# Altium project bme_ads1299.PrjPcb
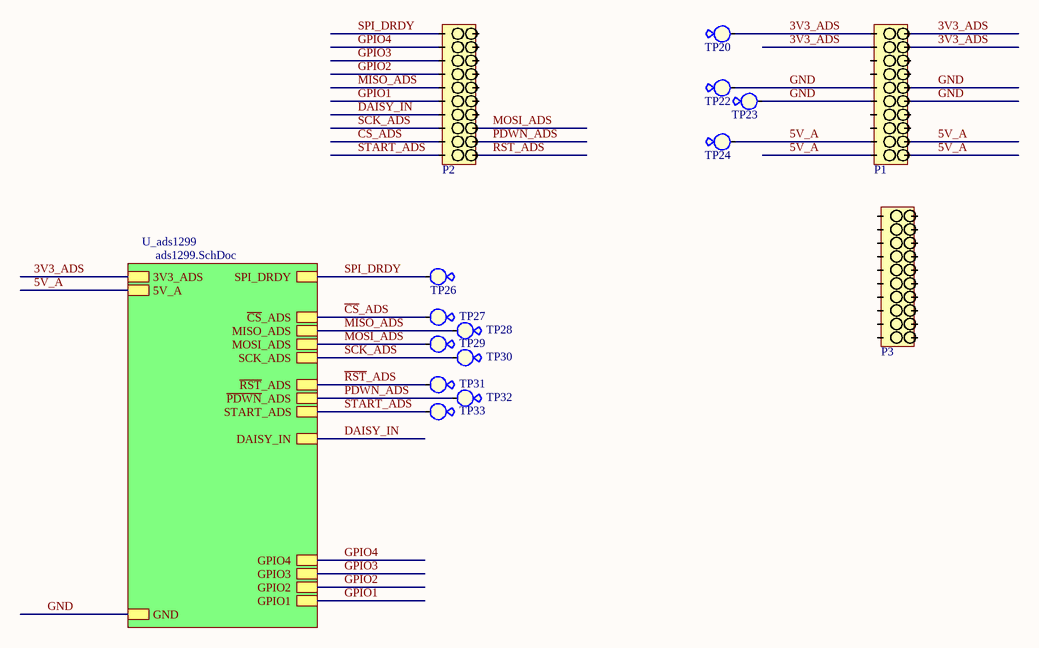
[diagram p0: bme_ads1299.SchDoc]
2 sheets, 104 parts. Net scope: strictly hierarchical (ports join the sheet entries above them; power ports are local).
Board file: ads1299.PcbDoc
Sheets:
  bme_ads1299.SchDoc
    U_ads1299 = ads1299.SchDoc

## Sheet bme_ads1299.SchDoc
size A4; DocumentNumber: 1; SheetNumber: 1; SheetTotal: 2

### Parts
P1  Mount Header (Male) 1.27mm  [M50-4301045]  (value not drawn)
P2  Mount Header (Male) 1.27mm  [M50-4301045]  (value not drawn)
P3  Mount Header (Male) 1.27mm  [M50-4301045]  (value not drawn)
TP20  Test Point  [testPoint]  (value not drawn)
TP22  Test Point  [testPoint]  (value not drawn)
TP23  Test Point  [testPoint]  (value not drawn)
TP24  Test Point  [testPoint]  (value not drawn)
TP26  Test Point  [testPoint]  (value not drawn)
TP27  Test Point  [testPoint]  (value not drawn)
TP28  Test Point  [testPoint]  (value not drawn)
TP29  Test Point  [testPoint]  (value not drawn)
TP30  Test Point  [testPoint]  (value not drawn)
TP31  Test Point  [testPoint]  (value not drawn)
TP32  Test Point  [testPoint]  (value not drawn)
TP33  Test Point  [testPoint]  (value not drawn)

### Sub-sheets
U_ads1299 = ads1299.SchDoc: GPIO4, GPIO2, GPIO3, START_ADS, GPIO1, DAISY_IN, 3V3_ADS, 5V_A, GND, SCK_ADS, MISO_ADS, MOSI_ADS, ~{CS}_ADS, ~{RST}_ADS, ~{PDWN}_ADS, SPI_DRDY

### Nets
3V3_ADS: P1.1 P1.2 P1.19 P1.20 TP20.0 ; sheet U_ads1299/3V3_ADS
5V_A: P1.9 P1.10 P1.11 P1.12 TP24.0 ; sheet U_ads1299/5V_A
GND: P1.5 P1.6 P1.15 P1.16 TP22.0 TP23.0 ; sheet U_ads1299/GND
~{CS}_ADS: P2.9 TP27.0 ; sheet U_ads1299/~{CS}_ADS
DAISY_IN: P2.7 ; sheet U_ads1299/DAISY_IN
GPIO1: P2.6 ; sheet U_ads1299/GPIO1
GPIO2: P2.4 ; sheet U_ads1299/GPIO2
GPIO3: P2.3 ; sheet U_ads1299/GPIO3
GPIO4: P2.2 ; sheet U_ads1299/GPIO4
MISO_ADS: P2.5 TP28.0 ; sheet U_ads1299/MISO_ADS
MOSI_ADS: P2.13 TP29.0 ; sheet U_ads1299/MOSI_ADS
~{PDWN}_ADS: P2.12 TP32.0 ; sheet U_ads1299/~{PDWN}_ADS
~{RST}_ADS: P2.11 TP31.0 ; sheet U_ads1299/~{RST}_ADS
SCK_ADS: P2.8 TP30.0 ; sheet U_ads1299/SCK_ADS
SPI_DRDY: P2.1 TP26.0 ; sheet U_ads1299/SPI_DRDY
START_ADS: P2.10 TP33.0 ; sheet U_ads1299/START_ADS

Not connected (* = marked no-connect by the designer): P1 3 4 7 8 13 14 17 18; P2 14 15 16 17 18 19 20; P3 1 2 3 4 5 6 7 8 9 10 11 12 13 14 15 16 17 18 19 20

### Library data of the parts
P1-P3 = 2x10 Mount Header (Male) 1.27mm: 2x10 Mount Header (Male); Value: 2x10 Mount Header, 1.27mm; Farnell: 1099531; Supplier: Krille har
TP20 TP22-TP24 TP26-TP33 = Test Point: Value: Test point; Farnell: 1702006

## Sheet ads1299.SchDoc
size A3; DocumentNumber: 2; SheetNumber: 2; SheetTotal: 2
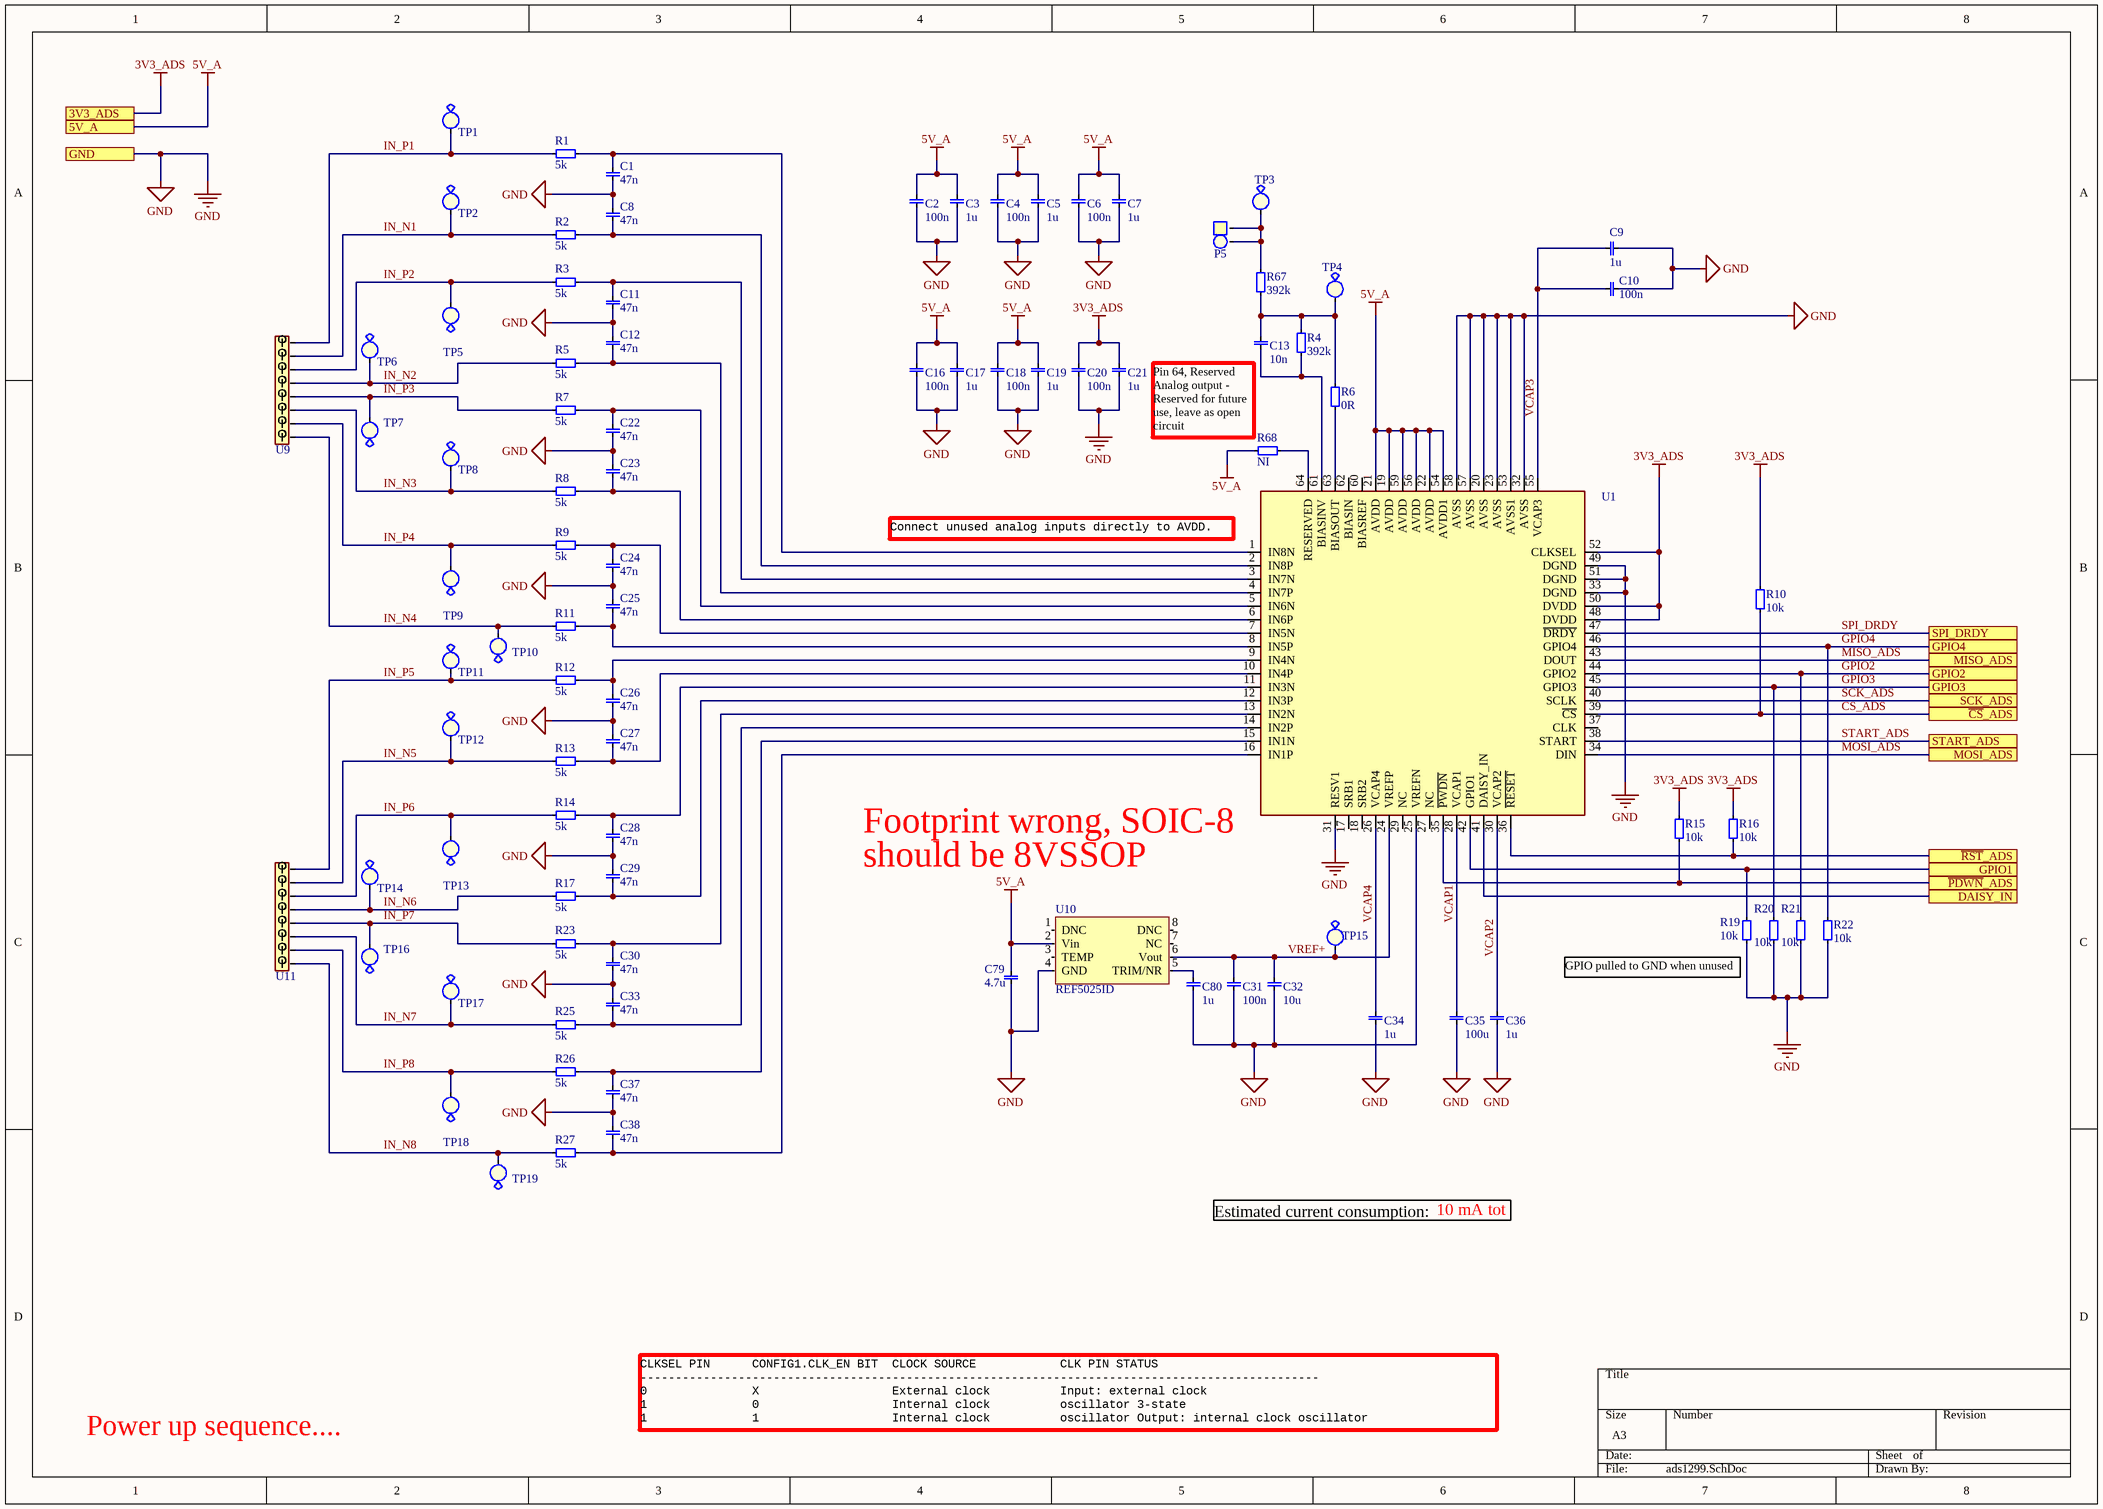
[diagram p1: ads1299.SchDoc]

### Parts
C1  value 47n  [0603 cap]  (hidden comment: 0603, capacitor)
C2  value 100n  [0603 cap]  (hidden comment: 0603, capacitor)
C3  value 1u  [0603 cap]  (hidden comment: 0603, capacitor)
C4  value 100n  [0603 cap]  (hidden comment: 0603, capacitor)
C5  value 1u  [0603 cap]  (hidden comment: 0603, capacitor)
C6  value 100n  [0603 cap]  (hidden comment: 0603, capacitor)
C7  value 1u  [0603 cap]  (hidden comment: 0603, capacitor)
C8  value 47n  [0603 cap]  (hidden comment: 0603, capacitor)
C9  value 1u  [0603 cap]  (hidden comment: 0603, capacitor)
C10  value 100n  [0603 cap]  (hidden comment: 0603, capacitor)
C11  value 47n  [0603 cap]  (hidden comment: 0603, capacitor)
C12  value 47n  [0603 cap]  (hidden comment: 0603, capacitor)
C13  value 10n  [0603 cap]  (hidden comment: 0603, capacitor)
C16  value 100n  [0603 cap]  (hidden comment: 0603, capacitor)
C17  value 1u  [0603 cap]  (hidden comment: 0603, capacitor)
C18  value 100n  [0603 cap]  (hidden comment: 0603, capacitor)
C19  value 1u  [0603 cap]  (hidden comment: 0603, capacitor)
C20  value 100n  [0603 cap]  (hidden comment: 0603, capacitor)
C21  value 1u  [0603 cap]  (hidden comment: 0603, capacitor)
C22  value 47n  [0603 cap]  (hidden comment: 0603, capacitor)
C23  value 47n  [0603 cap]  (hidden comment: 0603, capacitor)
C24  value 47n  [0603 cap]  (hidden comment: 0603, capacitor)
C25  value 47n  [0603 cap]  (hidden comment: 0603, capacitor)
C26  value 47n  [0603 cap]  (hidden comment: 0603, capacitor)
C27  value 47n  [0603 cap]  (hidden comment: 0603, capacitor)
C28  value 47n  [0603 cap]  (hidden comment: 0603, capacitor)
C29  value 47n  [0603 cap]  (hidden comment: 0603, capacitor)
C30  value 47n  [0603 cap]  (hidden comment: 0603, capacitor)
C31  value 100n  [0603 cap]  (hidden comment: 0603, capacitor)
C32  value 10u  [0603 cap]  (hidden comment: 0603, capacitor)
C33  value 47n  [0603 cap]  (hidden comment: 0603, capacitor)
C34  value 1u  [0603 cap]  (hidden comment: 0603, capacitor)
C35  value 100u  [1210, cap]  (hidden comment: 1210, capacitor)
C36  value 1u  [0603 cap]  (hidden comment: 0603, capacitor)
C37  value 47n  [0603 cap]  (hidden comment: 0603, capacitor)
C38  value 47n  [0603 cap]  (hidden comment: 0603, capacitor)
C79  value 4.7u  [0603 cap]  (hidden comment: 0603, capacitor)
C80  value 1u  [0603 cap]  (hidden comment: 0603, capacitor)
P5  1x2 Pin Header  [padtwo_L]  (value not drawn)
R1  value 5k  [0603]  (hidden comment: 0603, resistor)
R2  value 5k  [0603]  (hidden comment: 0603, resistor)
R3  value 5k  [0603]  (hidden comment: 0603, resistor)
R4  value 392k  [0603]  (hidden comment: 0603, resistor)
R5  value 5k  [0603]  (hidden comment: 0603, resistor)
R6  value 0R  [0603]  (hidden comment: 0603, resistor)
R7  value 5k  [0603]  (hidden comment: 0603, resistor)
R8  value 5k  [0603]  (hidden comment: 0603, resistor)
R9  value 5k  [0603]  (hidden comment: 0603, resistor)
R10  value 10k  [0603]  (hidden comment: 0603, resistor)
R11  value 5k  [0603]  (hidden comment: 0603, resistor)
R12  value 5k  [0603]  (hidden comment: 0603, resistor)
R13  value 5k  [0603]  (hidden comment: 0603, resistor)
R14  value 5k  [0603]  (hidden comment: 0603, resistor)
R15  value 10k  [0603]  (hidden comment: 0603, resistor)
R16  value 10k  [0603]  (hidden comment: 0603, resistor)
R17  value 5k  [0603]  (hidden comment: 0603, resistor)
R19  value 10k  [0603]  (hidden comment: 0603, resistor)
R20  value 10k  [0603]  (hidden comment: 0603, resistor)
R21  value 10k  [0603]  (hidden comment: 0603, resistor)
R22  value 10k  [0603]  (hidden comment: 0603, resistor)
R23  value 5k  [0603]  (hidden comment: 0603, resistor)
R25  value 5k  [0603]  (hidden comment: 0603, resistor)
R26  value 5k  [0603]  (hidden comment: 0603, resistor)
R27  value 5k  [0603]  (hidden comment: 0603, resistor)
R67  value 392k  [0603]  (hidden comment: 0603, resistor)
R68  value NI  [0603]  (hidden comment: 0603, resistor)
TP1  Test Point  [testPoint]  (value not drawn)
TP2  Test Point  [testPoint]  (value not drawn)
TP3  Test Point  [testPoint]  (value not drawn)
TP4  Test Point  [testPoint]  (value not drawn)
TP5  Test Point  [testPoint]  (value not drawn)
TP6  Test Point  [testPoint]  (value not drawn)
TP7  Test Point  [testPoint]  (value not drawn)
TP8  Test Point  [testPoint]  (value not drawn)
TP9  Test Point  [testPoint]  (value not drawn)
TP10  Test Point  [testPoint]  (value not drawn)
TP11  Test Point  [testPoint]  (value not drawn)
TP12  Test Point  [testPoint]  (value not drawn)
TP13  Test Point  [testPoint]  (value not drawn)
TP14  Test Point  [testPoint]  (value not drawn)
TP15  Test Point  [testPoint]  (value not drawn)
TP16  Test Point  [testPoint]  (value not drawn)
TP17  Test Point  [testPoint]  (value not drawn)
TP18  Test Point  [testPoint]  (value not drawn)
TP19  Test Point  [testPoint]  (value not drawn)
U1  ADS1299  [TQFP64_05MM_P]  (value not drawn)
U9  1x8 Screw terminal  [screw_term_8_pos]  (value not drawn)
U10  REF5025ID  [SOIC8]
U11  1x8 Screw terminal  [screw_term_8_pos]  (value not drawn)

### Ports
3V3_ADS, 5V_A, DAISY_IN, GND, GPIO1, GPIO2, GPIO3, GPIO4, MISO_ADS, MOSI_ADS, SCK_ADS, SPI_DRDY, START_ADS, ~{CS}_ADS, ~{PDWN}_ADS, ~{RST}_ADS

### Nets
3V3_ADS: C20.1 C21.1 R10.0 R15.0 R16.0 U1.48(DVDD) U1.50(DVDD) U1.52(CLKSEL) ; port 3V3_ADS
5V_A: C2.1 C3.1 C4.1 C5.1 C6.1 C7.1 C16.1 C17.1 C18.1 C19.1 C79.1 R68.0 U1.19(AVDD) U1.21(AVDD) U1.22(AVDD) U1.54(AVDD1) U1.56(AVDD) U1.59(AVDD) U10.2(Vin) ; port 5V_A
GND: C1.0 C2.0 C3.0 C4.0 C5.0 C6.0 C7.0 C8.0 C9.0 C10.0 C11.0 C12.0 C16.0 C17.0 C18.0 C19.0 C20.0 C21.0 C22.0 C23.0 C24.0 C25.0 C26.0 C27.0 C28.0 C29.0 C30.0 C31.0 C32.0 C33.0 C34.0 C35.0 C36.0 C37.0 C38.0 C79.0 C80.0 R19.1 R20.1 R21.1 R22.1 U1.20(AVSS) U1.23(AVSS) U1.25(VREFN) U1.31(RESV1) U1.32(AVSS) U1.33(DGND) U1.49(DGND) U1.51(DGND) U1.53(AVSS1) U1.57(AVSS) U1.58(AVSS) U10.4(GND) ; port GND
~{CS}_ADS: R10.1 U1.39(~{CS}) ; port ~{CS}_ADS
DAISY_IN: U1.41(DAISY_IN) ; port DAISY_IN
GPIO1: R19.0 U1.42(GPIO1) ; port GPIO1
GPIO2: R21.0 U1.44(GPIO2) ; port GPIO2
GPIO3: R20.0 U1.45(GPIO3) ; port GPIO3
GPIO4: R22.0 U1.46(GPIO4) ; port GPIO4
IN_N1: R2.1 TP2.0 U9.2
IN_N2: R5.1 TP6.0 U9.4
IN_N3: R8.1 TP8.0 U9.6
IN_N4: R11.1 TP10.0 U9.8
IN_N5: R13.1 TP12.0 U11.2
IN_N6: R17.1 TP14.0 U11.4
IN_N7: R25.1 TP17.0 U11.6
IN_N8: R27.1 TP19.0 U11.8
IN_P1: R1.1 TP1.0 U9.1
IN_P2: R3.1 TP5.0 U9.3
IN_P3: R7.1 TP7.0 U9.5
IN_P4: R9.1 TP9.0 U9.7
IN_P5: R12.1 TP11.0 U11.1
IN_P6: R14.1 TP13.0 U11.3
IN_P7: R23.1 TP16.0 U11.5
IN_P8: R26.1 TP18.0 U11.7
MISO_ADS: U1.43(DOUT) ; port MISO_ADS
MOSI_ADS: U1.34(DIN) ; port MOSI_ADS
~{PDWN}_ADS: R15.1 U1.35(~{PWDN}) ; port ~{PDWN}_ADS
~{RST}_ADS: R16.1 U1.36(~{RESET}) ; port ~{RST}_ADS
SCK_ADS: U1.40(SCLK) ; port SCK_ADS
SPI_DRDY: U1.47(~{DRDY}) ; port SPI_DRDY
START_ADS: U1.38(START) ; port START_ADS
VCAP1: C35.1 U1.28(VCAP1)
VCAP2: C36.1 U1.30(VCAP2)
VCAP3: C9.1 C10.1 U1.55(VCAP3)
VCAP4: C34.1 U1.26(VCAP4)
VREF+: C31.1 C32.1 TP15.0 U1.24(VREFP) U10.6(Vout)
NetC1_1: C1.1 R1.0 U1.1(IN8N)
NetC8_1: C8.1 R2.0 U1.2(IN8P)
NetC11_1: C11.1 R3.0 U1.3(IN7N)
NetC12_1: C12.1 R5.0 U1.4(IN7P)
NetC13_0: C13.0 R4.1 U1.61(BIASINV)
NetC13_1: C13.1 R4.0 R6.0 R67.1 TP4.0
NetC22_1: C22.1 R7.0 U1.5(IN6N)
NetC23_1: C23.1 R8.0 U1.6(IN6P)
NetC24_1: C24.1 R9.0 U1.7(IN5N)
NetC25_1: C25.1 R11.0 U1.8(IN5P)
NetC26_1: C26.1 R12.0 U1.9(IN4N)
NetC27_1: C27.1 R13.0 U1.10(IN4P)
NetC28_1: C28.1 R14.0 U1.11(IN3N)
NetC29_1: C29.1 R17.0 U1.12(IN3P)
NetC30_1: C30.1 R23.0 U1.13(IN2N)
NetC33_1: C33.1 R25.0 U1.14(IN2P)
NetC37_1: C37.1 R26.0 U1.15(IN1N)
NetC38_1: C38.1 R27.0 U1.16(IN1P)
NetC80_1: C80.1 U10.5(TRIM/NR)
NetP5_1: P5.1 P5.2 R67.0 TP3.0
NetR6_1: R6.1 U1.63(BIASOUT)
NetR68_1: R68.1 U1.64(RESERVED)

Not connected (* = marked no-connect by the designer): U1 17(SRB1) 18(SRB2) 27(NC) 29(NC) 37(CLK) 60(BIASREF) 62(BIASIN); U10 1(DNC) 3(TEMP) 7(NC) 8(DNC)

### Notes on the sheet
- Pin 64, Reserved Analog output - Reserved for future use, leave as open circuit
- (near U1) Connect unused analog inputs directly to AVDD.
- (near U1) Footprint wrong, SOIC-8
- should be 8VSSOP
- (near R19) GPIO pulled to GND when unused
- Estimated current consumption:
- 10 mA tot
- Power up sequence....
- CLKSEL PIN      CONFIG1.CLK_EN BIT  CLOCK SOURCE            CLK PIN STATUS
  -------------------------------------------------------------------------------------------------
  0               X                   External clock          Input: external clock
  1               0                   Internal clock          oscillator 3-state
  1               1                   Internal clock          oscillator Output: internal clock oscillator

### Library data of the parts
C1 C8 C11 C12 C22-C30 C33 C37 C38 = 0603, capacitor: Order number: 1276-1063-1-ND; Supplier: Digikey
C2 C4 C6 C10 C16 C18 C20 C31 = 0603, capacitor: CAP CER 0.1UF 50V, 10% X7R 0603; Order number: 1276-CL10B104KB8NNNLCT-ND; Supplier: Digikey
C3 C5 C7 C9 C17 C19 C21 C34 C36 C80 = 0603, capacitor: CAP CER 1UF 25V, 10% X5R 0603; Order number: 445-7468-1-ND; Supplier: Digikey
C13 = 0603, capacitor: Order number: 445-14147-1-ND
C32 = 0603, capacitor: CAP CER 1UF 25V, 10% X5R 0603; Order number: 587-6023-1-ND; Supplier: Digikey
C35 = 1210, capacitor: Order number: 587-1965-1-ND; Supplier: Digikey
C79 = 0603, capacitor: CAP CER 1UF 25V, 10% X5R 0603; Order number: 587-4321-1-ND
P5 = 1x2 Pin Header: 2.54 mm, TH; Value: 1x2 Pin Header
R1-R3 R5 R7-R9 R11-R14 R17 R23 R25-R27 = 0603, resistor: Order number: 311-2629-1-ND; Supplier: Digikey
R4 R67 = 0603, resistor: Order number: P392KHCT-ND; Supplier: Digikey
R6 = 0603, resistor: Order number: RMCF0603ZT0R00CT-ND; Supplier: Digikey
R10 R15 R16 R19-R22 = 0603, resistor: Order number: RHM10KADCT-ND; Supplier: Digikey
U1 = ADS1299: 24-Bit, Analog-to-Digital Converter for EEG and / Biopotential Measurements
U9 U11 = 1x8 Screw terminal: Order number: A98338-ND; Supplier: Digikey
U10 = REF5025ID: Order number: 296-24499-1-ND; Value: REF5025ID; Supplier: Digikey
TP1-TP19 = Test Point: Value: Test point; Farnell: 1702006

## Nets that join several sheets
3V3_ADS: bme_ads1299 (5 pins), ads1299 (8 pins)
5V_A: bme_ads1299 (5 pins), ads1299 (19 pins)
GND: bme_ads1299 (6 pins), ads1299 (53 pins)
~{CS}_ADS: bme_ads1299 (P2.9 TP27.0), ads1299 (R10.1 U1.39)
DAISY_IN: bme_ads1299 (P2.7), ads1299 (U1.41)
GPIO1: bme_ads1299 (P2.6), ads1299 (R19.0 U1.42)
GPIO2: bme_ads1299 (P2.4), ads1299 (R21.0 U1.44)
GPIO3: bme_ads1299 (P2.3), ads1299 (R20.0 U1.45)
GPIO4: bme_ads1299 (P2.2), ads1299 (R22.0 U1.46)
MISO_ADS: bme_ads1299 (P2.5 TP28.0), ads1299 (U1.43)
MOSI_ADS: bme_ads1299 (P2.13 TP29.0), ads1299 (U1.34)
~{PDWN}_ADS: bme_ads1299 (P2.12 TP32.0), ads1299 (R15.1 U1.35)
~{RST}_ADS: bme_ads1299 (P2.11 TP31.0), ads1299 (R16.1 U1.36)
SCK_ADS: bme_ads1299 (P2.8 TP30.0), ads1299 (U1.40)
SPI_DRDY: bme_ads1299 (P2.1 TP26.0), ads1299 (U1.47)
START_ADS: bme_ads1299 (P2.10 TP33.0), ads1299 (U1.38)